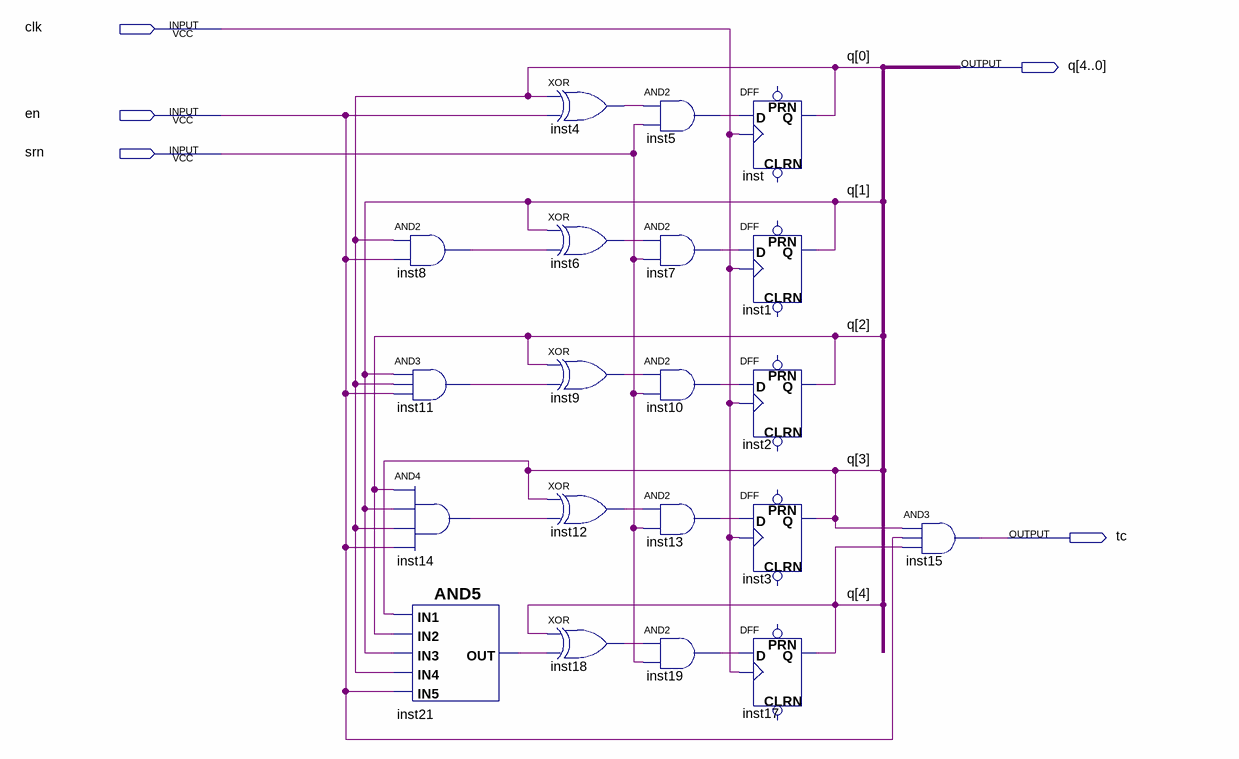
[diagram p0: schematic sheet]
// Quartus schematic crt5div25.bdf as structural Verilog: 20 symbols, 5 pins
module crt5div25 (
  input  clk,
  input  en,
  input  srn,
  output [4:0] q,
  output tc
);

  wire inst4_out, inst5_out, inst6_out, inst7_out, inst8_out, inst9_out, inst10_out, inst11_out, inst12_out,
       inst13_out, inst14_out, inst18_out, inst19_out, inst21_out;

  and inst8 (inst8_out, q[0], en);
  and inst11 (inst11_out, q[1], q[0], en);
  and inst14 (inst14_out, q[2], q[1], q[0], en);
  and inst21 (inst21_out, q[3], q[2], q[1], q[0], en);
  xor inst4 (inst4_out, q[0], en);
  xor inst6 (inst6_out, q[1], inst8_out);
  xor inst9 (inst9_out, q[2], inst11_out);
  xor inst12 (inst12_out, q[3], inst14_out);
  xor inst18 (inst18_out, q[4], inst21_out);
  and inst5 (inst5_out, inst4_out, srn);
  and inst7 (inst7_out, inst6_out, srn);
  and inst10 (inst10_out, inst9_out, srn);
  and inst13 (inst13_out, inst12_out, srn);
  and inst19 (inst19_out, inst18_out, srn);
  DFF inst (.CLK(clk), .D(inst5_out), .Q(q[0]));  // open: CLRN, PRN
  DFF inst1 (.CLK(clk), .D(inst7_out), .Q(q[1]));  // open: CLRN, PRN
  DFF inst2 (.CLK(clk), .D(inst10_out), .Q(q[2]));  // open: CLRN, PRN
  DFF inst3 (.CLK(clk), .D(inst13_out), .Q(q[3]));  // open: CLRN, PRN
  DFF inst17 (.CLK(clk), .D(inst19_out), .Q(q[4]));  // open: CLRN, PRN
  and inst15 (tc, q[3], en, q[4]);
endmodule
